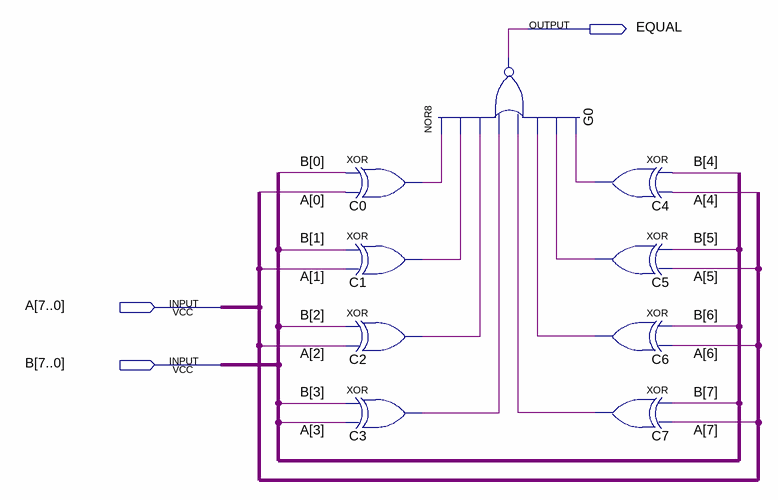
[diagram p0: schematic sheet]
// Quartus schematic comparator8bit.bdf as structural Verilog: 9 symbols, 3 pins
module comparator8bit (
  input  [7:0] A,
  input  [7:0] B,
  output EQUAL
);

  wire C0_out, C1_out, C2_out, C3_out, C4_out, C5_out, C6_out, C7_out;

  xor C0 (C0_out, B[0], A[0]);
  xor C1 (C1_out, B[1], A[1]);
  xor C2 (C2_out, B[2], A[2]);
  xor C3 (C3_out, B[3], A[3]);
  nor G0 (EQUAL, C0_out, C1_out, C2_out, C3_out, C7_out, C6_out, C5_out, C4_out);
  xor C4 (C4_out, B[4], A[4]);
  xor C5 (C5_out, B[5], A[5]);
  xor C6 (C6_out, B[6], A[6]);
  xor C7 (C7_out, B[7], A[7]);
endmodule
